# Altium schematic sheet 5V Reference.SchDoc
size A
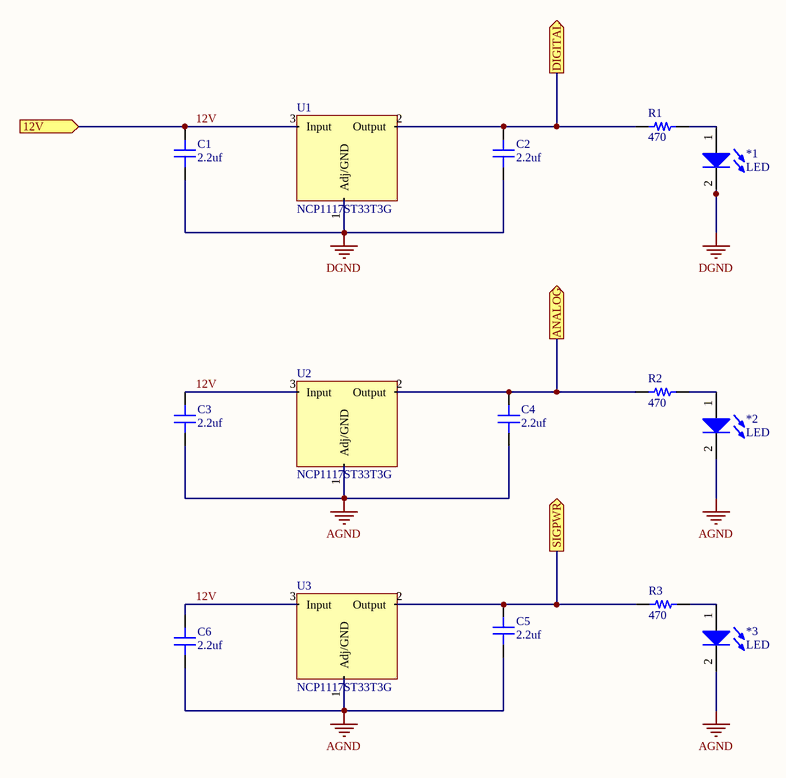
[diagram p0: 5V Reference.SchDoc]

## Parts
*1  LED  [0805_LED]
*2  LED  [0805_LED]
*3  LED  [0805_LED]
C1  value 2.2uf  [CAP 0805/2012]  (hidden comment: Capacitor MLCC 2.2uf 25V CAP 0805/2012)
C2  value 2.2uf  [CAP 0805/2012]  (hidden comment: Capacitor MLCC 2.2uf 25V CAP 0805/2012)
C3  value 2.2uf  [CAP 0805/2012]  (hidden comment: Capacitor MLCC 2.2uf 25V CAP 0805/2012)
C4  value 2.2uf  [CAP 0805/2012]  (hidden comment: Capacitor MLCC 2.2uf 25V CAP 0805/2012)
C5  value 2.2uf  [CAP 0805/2012]  (hidden comment: Capacitor MLCC 2.2uf 25V CAP 0805/2012)
C6  value 2.2uf  [CAP 0805/2012]  (hidden comment: Capacitor MLCC 2.2uf 25V CAP 0805/2012)
R1  value 470  [RES 0805/2012]  (hidden comment: Resistor 470 0805 1/10W 1%)
R2  value 470  [RES 0805/2012]  (hidden comment: Resistor 470 0805 1/10W 1%)
R3  value 470  [RES 0805/2012]  (hidden comment: Resistor 470 0805 1/10W 1%)
U1  NCP1117ST33T3G  [SOT-223-3]
U2  NCP1117ST33T3G  [SOT-223-3]
U3  NCP1117ST33T3G  [SOT-223-3]

## Ports
12V (in), ANALOG (out), DIGITAL (out), SIGPWR (out)

## Nets
AGND: *2.2(K) *3.2(K) C3.1 C4.1 C5.1 C6.1 U2.1(Adj/GND) U3.1(Adj/GND)
DGND: *1.2(K) C1.1 C2.1 U1.1(Adj/GND)
12V: C1.2 C3.2 C6.2 U1.3(Input) U2.3(Input) U3.3(Input) ; port 12V
ANALOG: C4.2 R2.1 U2.2(Output) ; port ANALOG
DIGITAL: C2.2 R1.1 U1.2(Output) ; port DIGITAL
SIGPWR: C5.2 R3.1 U3.2(Output) ; port SIGPWR
Net*1_1: *1.1(A) R1.2
Net*2_1: *2.1(A) R2.2
Net*3_1: *3.1(A) R3.2

## Library data of the parts
*1-*3 = 2: Manufacturer_id: 1; idLED: 2; Name: CMD17_0805_GREEN; Value: Green; Brightness: 7mcd; Id: 20mA; Vf: 2.1V; Drawer_id: 1; Package: 0805; Link: https://www.digikey.com/product-detail/en/visual-communications-company-vcc/CMD17-21VGD-TR8/L62505CT-ND/254936
C1-C6 = 711: Manufacturer_id: 1; idCapacitor: 711; Name: Cap_2.2uf_25V_CAP 0805/2012; Dielectric: Ceramic; Created_By: Nick Mah; Drawer_id: 1; Voltage_Rating: 25V; Package: CAP 0805/2012; Created_Date: 10/20/2018
R1-R3 = 497: Manufacturer_id: 1; idResistor: 497; Name: Res_470_0805_1/10W_1%; Created_By: Nick Mah; Supplier 1: Digi-Key; Drawer_id: 1; Tolerance: 1%; Power: 1/10W; Package: 0805; ComponentLink1Description: Datasheet; Created_Date: 2018-10-20
U1-U3 = 15: 1.0 A Low Dropout Positive and Adjustable Voltage Regulator; Manufacturer_id: 1; idPMIC_Lin: 15; Name: 3.3V 1.0A LDO; Value: 3.3V 1.0A; Vin(Max): 20V; Vout(Max): 3.3V; Current_Rating: 1A; Dropout_Voltage: 1.2V @ 800mA; Drawer_id: 1; Num_Outputs: 1; Package: SOT-223-3; MfrPartNo: NCP1117ST33T3G; Link: https://www.digikey.com/product-detail/en/on-semiconductor/NCP1117ST33T3G/NCP1117ST33T3GOSCT-ND/660708?utm_adgroup=Integrated%20Circuits&slid=&gclid=CjwKCAjwpKveBRAwEiwAo4Pqm-q33kFM8zFNc6HZ2F-pR13_ETd6YlqjCAqcJjAXoyQWdArbQQWp4hoCk3EQAvD_BwE